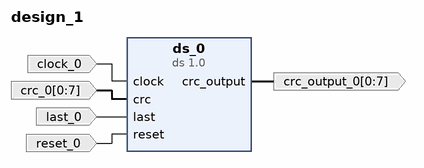
[diagram p0: block diagram of the top level]
# Vivado block design design_1, xczu7ev-ffvc1156-2-e, Vivado 2022.2.2
create_bd_design design_1

create_bd_port -dir I -type clk clock_0
create_bd_port -dir I -type rst reset_0
create_bd_port -dir I -from 0 -to 7 crc_0
create_bd_port -dir I last_0
create_bd_port -dir O -from 0 -to 7 crc_output_0

create_bd_cell -type ip -vlnv user.org:user:ds:1.0 ds_0

# ---- connections ----

connect_bd_net -net clock_0_1 [get_bd_ports clock_0] [get_bd_pins ds_0/clock]
connect_bd_net -net crc_0_1 [get_bd_ports crc_0] [get_bd_pins ds_0/crc]
connect_bd_net [get_bd_pins ds_0/crc_output] [get_bd_ports crc_output_0]
connect_bd_net -net last_0_1 [get_bd_ports last_0] [get_bd_pins ds_0/last]
connect_bd_net -net reset_0_1 [get_bd_ports reset_0] [get_bd_pins ds_0/reset]

validate_bd_design
save_bd_design
